# Altium schematic sheet NNP-DWG-125-001-000 PG4 Schematic Drawing Pg1.SchDoc
size B; CheckedBy: A. Zbrzeski; DocumentNumber: 51-2002-01; Revision: 04; SheetNumber: 1; SheetTotal: 8
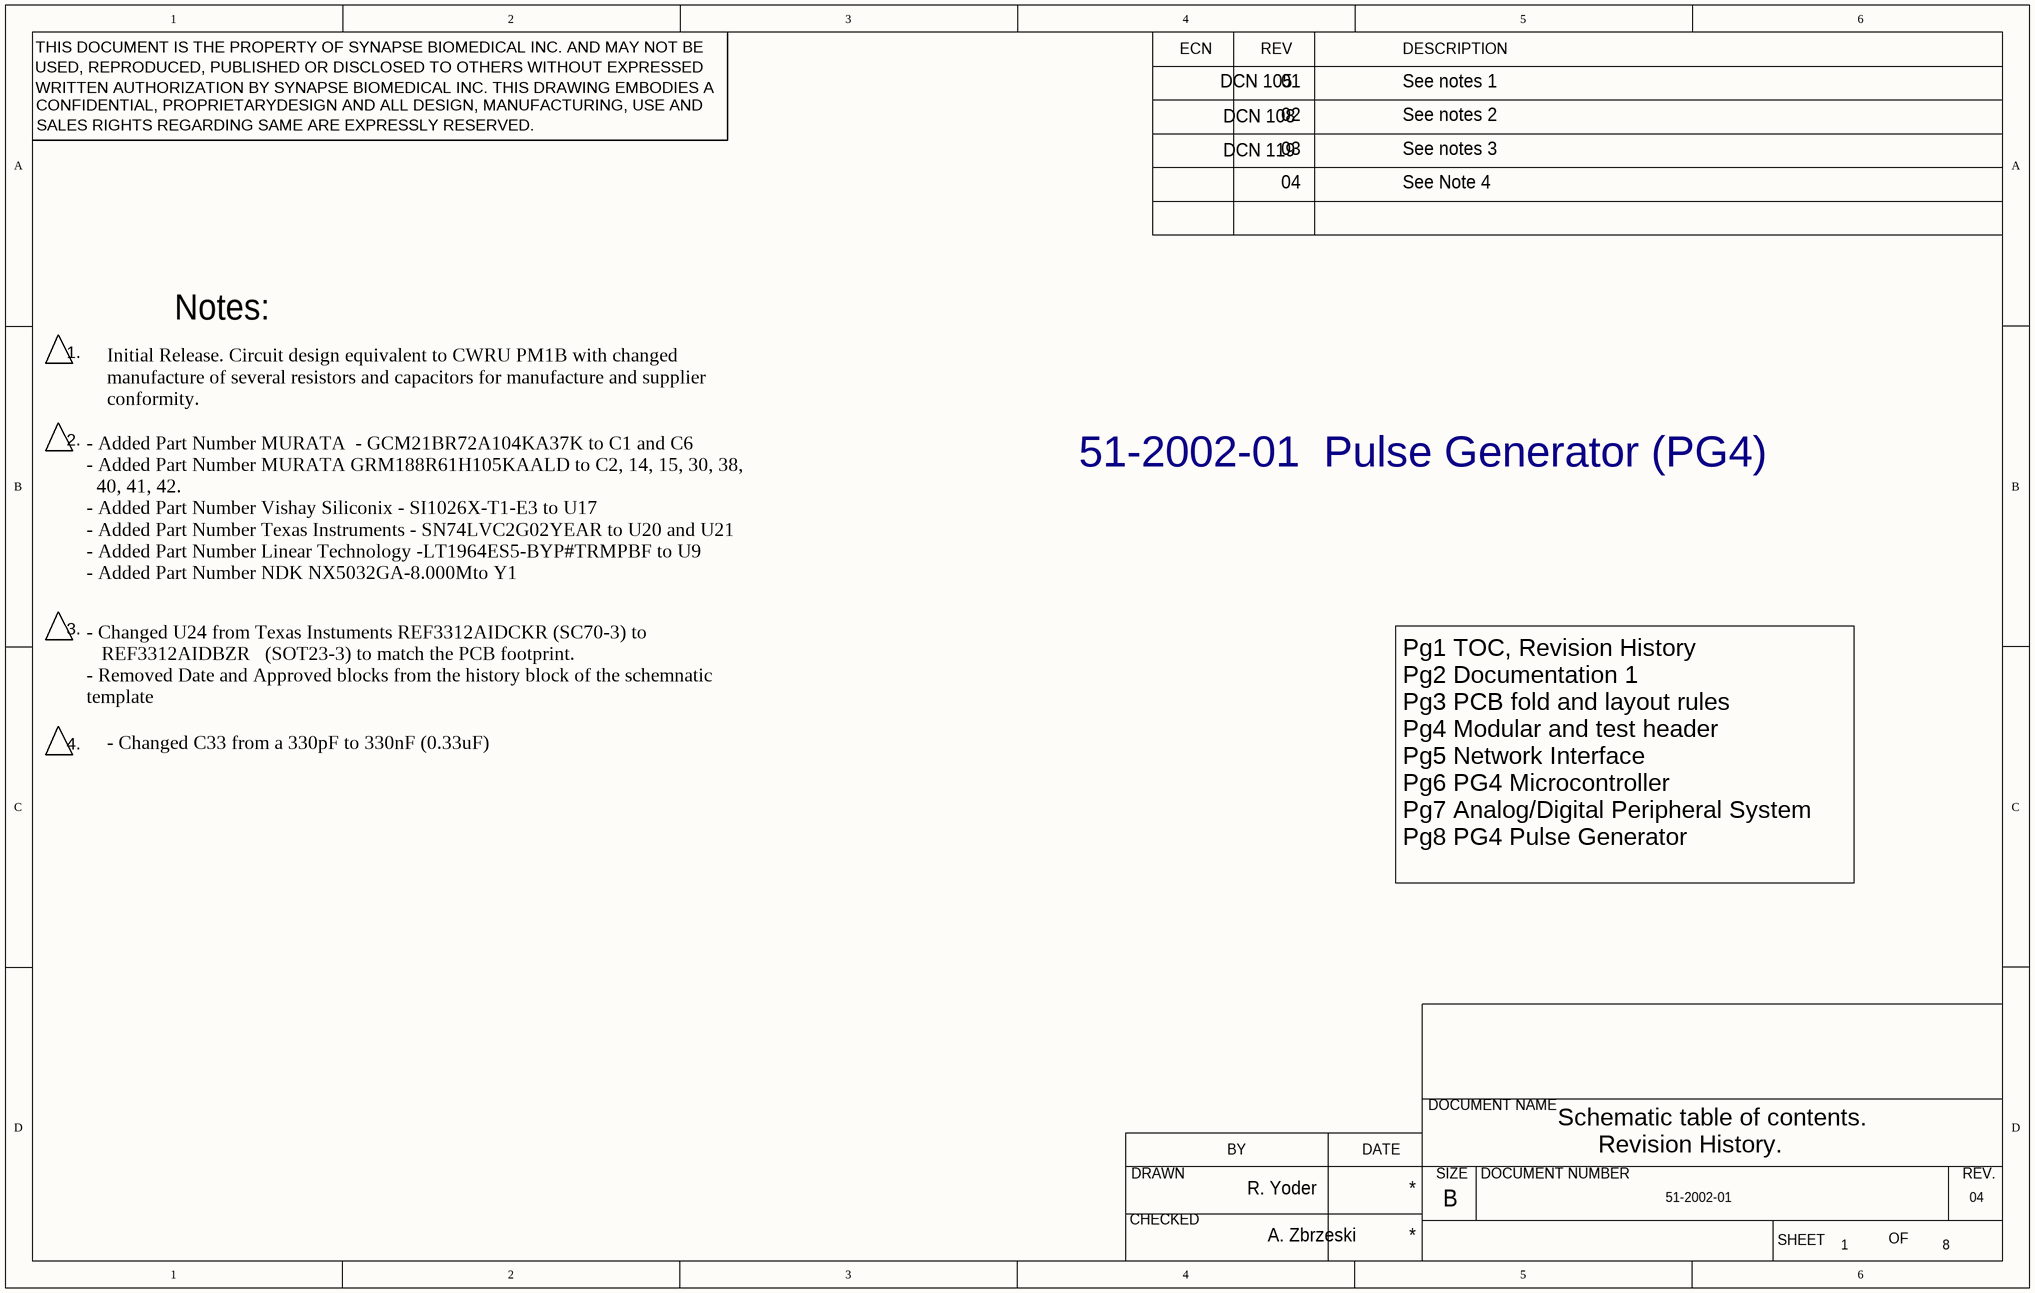
[diagram p0: NNP-DWG-125-001-000 PG4 Schematic Drawing Pg1.SchDoc]

## Notes on the sheet
- DCN 105
- 01
- See notes 1
- DCN 108
- DCN 119
- 02
- 03
- See notes 2
- See notes 3
- 04
- See Note 4
- 1.
- Notes:
- Initial Release. Circuit design equivalent to CWRU PM1B with changed manufacture of several resistors and capacitors for manufacture and supplier conformity.
- 2.
- 51-2002-01  Pulse Generator (PG4)
- 3.
- - Added Part Number MURATA  - GCM21BR72A104KA37K to C1 and C6
  - Added Part Number MURATA GRM188R61H105KAALD to C2, 14, 15, 30, 38,
  40, 41, 42.
  - Added Part Number Vishay Siliconix - SI1026X-T1-E3 to U17
  - Added Part Number Texas Instruments - SN74LVC2G02YEAR to U20 and U21
  - Added Part Number Linear Technology -LT1964ES5-BYP#TRMPBF to U9
  - Added Part Number NDK NX5032GA-8.000Mto Y1
- - Changed U24 from Texas Instuments REF3312AIDCKR (SC70-3) to
  REF3312AIDBZR   (SOT23-3) to match the PCB footprint.
  - Removed Date and Approved blocks from the history block of the schemnatic template
- 4.
- - Changed C33 from a 330pF to 330nF (0.33uF)
- Pg1 TOC, Revision History
  Pg2 Documentation 1
  Pg3 PCB fold and layout rules
  Pg4 Modular and test header
  Pg5 Network Interface
  Pg6 PG4 Microcontroller
  Pg7 Analog/Digital Peripheral System
  Pg8 PG4 Pulse Generator
- Schematic table of contents.
- Revision History.
- R. Yoder
- A. Zbrzeski
- THIS DOCUMENT IS THE PROPERTY OF SYNAPSE BIOMEDICAL INC. AND MAY NOT BE
- USED, REPRODUCED, PUBLISHED OR DISCLOSED TO OTHERS WITHOUT EXPRESSED
- CONFIDENTIAL, PROPRIETARYDESIGN AND ALL DESIGN, MANUFACTURING, USE AND
- WRITTEN AUTHORIZATION BY SYNAPSE BIOMEDICAL INC. THIS DRAWING EMBODIES A
- ECN
- REV
- DESCRIPTION
- SALES RIGHTS REGARDING SAME ARE EXPRESSLY RESERVED.
- DOCUMENT NAME
- DRAWN
- BY
- DATE
- SIZE
- DOCUMENT NUMBER
- REV.
- CHECKED
- B
- SHEET
- OF